# EAGLE design Qwiic Pressure Sensor - LPS25HB (EAGLE 9.0.1)
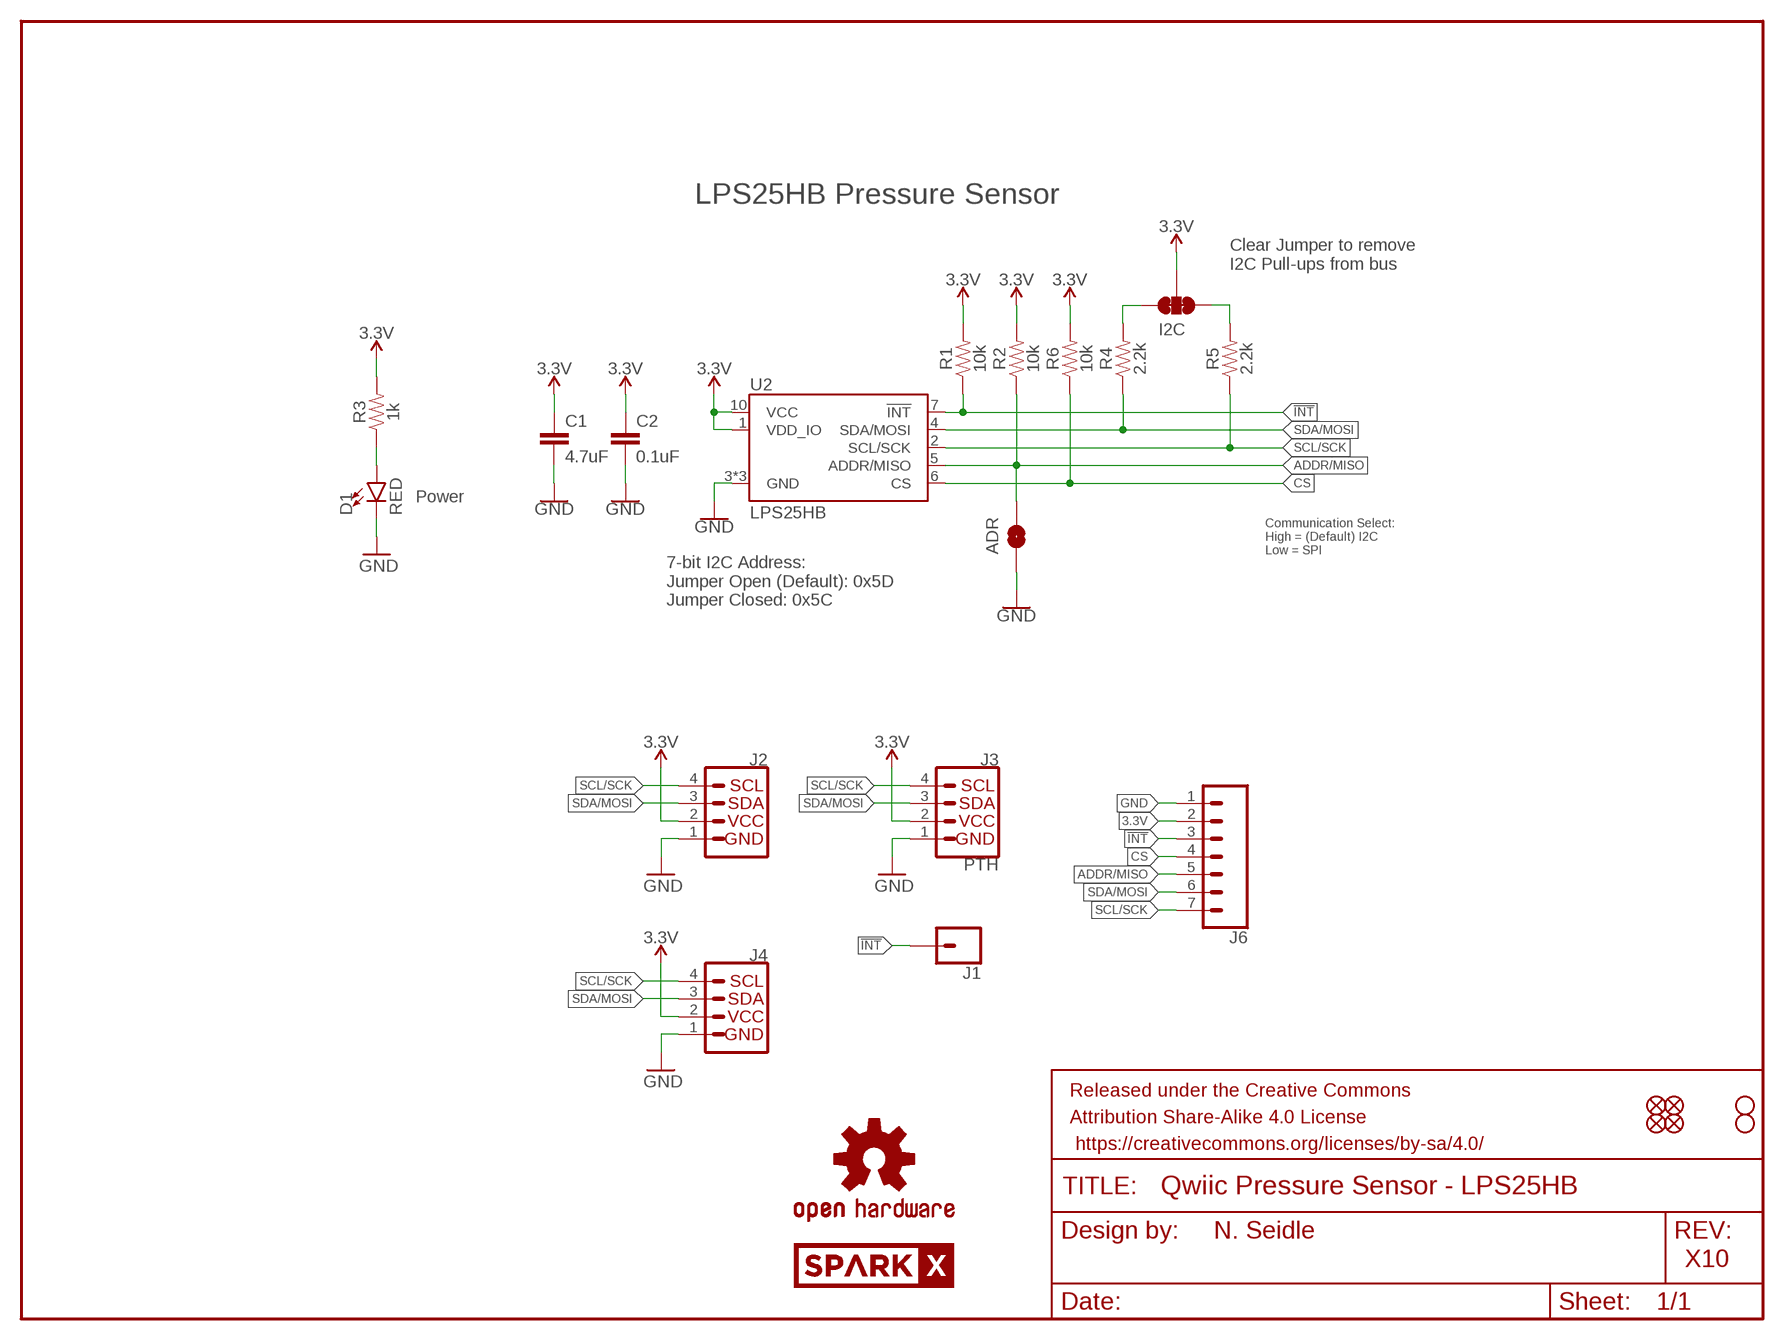
[diagram p0: schematic, sheet 1]

## Parts
ADR  JUMPER-SMT_2_NO_SILK  [SMT-JUMPER_2_NO_SILK]
C1  4.7uF  4.7UF0603  [0603]
C2  0.1uF  0.1UF-0603-25V-(+80/-20%)  [0603]
D1  RED  LED-RED0603  [LED-0603]
FRAME1  FRAME-LETTER  [CREATIVE_COMMONS]
I2C  JUMPER-SMT_3_2-NC_TRACE_SILK  [SMT-JUMPER_3_2-NC_TRACE_SILK]
J1  CONN_01PTH_NO_SILK_YES_STOP  [1X01_NO_SILK]
J2  I2C_STANDARDQWIIC  [1X04_1MM_RA]
J3  PTH  I2C_STANDARD_NO_SILK  [1X04_NO_SILK]
J4  I2C_STANDARDQWIIC  [1X04_1MM_RA]
J6  CONN_07NO_SILK  [1X07_NO_SILK]
JP1  FIDUCIALUFIDUCIAL  [MICRO-FIDUCIAL]
JP2  FIDUCIALUFIDUCIAL  [MICRO-FIDUCIAL]
JP3  STAND-OFF  [STAND-OFF]
JP4  STAND-OFF  [STAND-OFF]
JP5  FIDUCIALUFIDUCIAL  [MICRO-FIDUCIAL]
JP6  FIDUCIALUFIDUCIAL  [MICRO-FIDUCIAL]
LOGO1  OSHW-LOGOMINI  [OSHW-LOGO-MINI]
R1  10k  10KOHM-0603-1/10W-1%  [0603]
R2  10k  10KOHM-0603-1/10W-1%  [0603]
R3  1k  1KOHM-0603-1/10W-1%  [0603]
R4  2.2k  2.2KOHM-0603-1/10W-1%  [0603]
R5  2.2k  2.2KOHM-0603-1/10W-1%  [0603]
R6  10k  10KOHM-0603-1/10W-1%  [0603]
U2  LPS25HB  [LPS25HB]
U$2  SPARKX-LOGO4  [SPARKX-MEDIUM]

## Nets
3.3V: C1.1 C2.1 I2C.2 J2.2 J3.2(VCC) J4.2 J6.2 R1.2 R2.2 R3.2 R6.2 U2.1(VDD_IO) U2.10(VCC)
!INT: J1.1 J6.3 R1.1 U2.7(!INT)
ADDR/MISO: ADR.2 J6.5 R2.1 U2.5(ADDR/MISO)
CS: J6.4 R6.1 U2.6(CS)
GND: ADR.1 C1.2 C2.2 D1.C J2.1 J3.1(GND) J4.1 J6.1 U2.3(GND) U2.8(GND) U2.9(GND)
N$1: I2C.1 R5.2
N$2: I2C.3 R4.2
N$3: D1.A R3.1
SCL/SCK: J2.4 J3.4(SCL) J4.4 J6.7 R5.1 U2.2(SCL/SCK)
SDA/MOSI: J2.3 J3.3(SDA) J4.3 J6.6 R4.1 U2.4(SDA/MOSI)

## Notes on the sheet
- LPS25HB Pressure Sensor
- Clear Jumper to remove 
  I2C Pull-ups from bus
- Power
- Communication Select: 
  High = (Default) I2C
  Low = SPI
- 7-bit I2C Address:
  Jumper Open (Default): 0x5D
  Jumper Closed: 0x5C
- N. Seidle
- X10

## Library data of the parts
ADR = SparkFun-Jumpers:JUMPER-SMT_2_NO: Normally open jumper This jumper has two pads in close proximity to each other. Apply solder to close the connection. Round pads are easier to solder for beginners, but are a lot larger. SparkFun Product that uses the round pads: SparkFun EL Sequencer <https://www.sparkfun.com/products/12781>
C1 = SparkFun-Capacitors:4.7UF: 4.7µF ceramic capacitors A capacitor is a passive two-terminal electrical component used to store electrical energy temporarily in an electric field.; PROD_ID: CAP-08280
C2 = SparkFun-Capacitors:0.1UF: 0.1µF ceramic capacitors A capacitor is a passive two-terminal electrical component used to store electrical energy temporarily in an electric field.; PROD_ID: CAP-00810
D1 = SparkFun-LED:LED-RED: Red SMD LED Used in manufacturing of most products at SparkFun Packages: 0603 - SMD 0603 package [Product Link] <http://docs.avagotech.com/docs/AV02-0551EN> 0603 SMART - SMD 0603 SMART package ( more efficient and expensive)[Product Link] <http://www.osram-os.com/Graphics/XPic2/00077099_0.pdf> 1206 - SMD1206 package [Product Link] <https://www.sparkfun.com/datasheets/DevTools/LilyPad/Q150OVS4.pdff> SparkFun Products: Pro Mini 328 -5V <https://www.sparkfun.com/products/821> RedBoard <https://www.sparkfun.com/products/12757> IOIO-OTG <https://www.sparkfun.com/products/13613>; PROD_ID: DIO-00819
FRAME1 = SparkFun-Aesthetics:FRAME-LETTER: Schematic Frame - Letter Standard 8.5x11 US Letter frame
I2C = SparkFun-Jumpers:JUMPER-SMT_3_2-NC_TRACE: Normally closed trace jumper (2 of 2 connections) This jumper has a trace between all three pads so they are normally closed (NC). Use a razor knife to open the connection(s). For best results follow the IPC guidelines for cutting traces: Cutout at least 0.063 mm (0.005 in). Remove all loose material to clean up the cut area. Seal the cut with an approved epoxy. Reapply solder to reclose the connection(s).
J1 = SparkFun-Connectors:CONN_01: Single connection point. Often used as Generic Header-pin footprint for 0.1 inch spaced/style header connections On any of the 0.1 inch spaced packages, you can populate with these: Break Away Headers - Straight <https://www.sparkfun.com/products/116> (PRT-00116) Break Away Male Headers - Right Angle <https://www.sparkfun.com/products/553> (PRT-00553) Female Headers <https://www.sparkfun.com/products/115> (PRT-00115) Break Away Headers - Machine Pin <https://www.sparkfun.com/products/117> (PRT-00117) Break Away Female Headers - Swiss Machine Pin <https://www.sparkfun.com/products/743> (PRT-00743) This device is also useful as a general connection point to wire up your design to another part of your project. Our various solder wires solder well into these plated through hole pads. Hook-Up Wire - Assortment (Stranded, 22 AWG) <https://www.sparkfun.com/products/11375> (PRT-11375) Hook-Up Wire - Assortment (Solid Core, 22 AWG) <https://www.sparkfun.com/products/11367> (PRT-11367) View the entire wire category on our website here <https://www.sparkfun.com/categories/141> Special notes: SMTSO-256-ET is a "flush mount" nut for a 4-40 screw. We mostly use this on specialty testbeds; it is a nice way to connect hardware to your PCB at an adjustable hieght. Also note, the SNAP packages are for using a snappable style connector. We sell a baggie of snaps and they are also used on two LilyPad designs: Snap Assortment - 30 pack (male and female) <https://www.sparkfun.com/products/11347> (DEV-11347) LilyPad Arduino SimpleSnap <https://www.sparkfun.com/products/10941> (DEV-10941) LilyPad SimpleSnap Protoboard <https://www.sparkfun.com/products/10940> (DEV-10940)
J2 J4 = SparkFun-Connectors:I2C_STANDARD: SparkFun I2C Standard Pinout Header SparkFun has standardized on a pinout for all I2C based sensor breakouts. This pinout allows I2C boards to be plugged directly into the headers on Arduino Uno compatible boards, and to be daisy chained easily. Example SparkFun Products: SparkFun Atmospheric Sensor Breakout - BME280 <https://www.sparkfun.com/products/13676> SparkFun Altitude/Pressure Sensor Breakout - MPL3115A2 <https://www.sparkfun.com/products/11084> SparkFun TOF Range Finder Sensor - VL6180 <https://www.sparkfun.com/products/12785>; PROD_ID: CONN-13694; VALUE: Qwiic Right Angle
J3 = SparkX:I2C_STANDARD: SparkFun I2C Standard Pinout Header SparkFun has standardized on a pinout for all I2C based sensor breakouts. This pinout allows I2C boards to be plugged directly into the headers on Arduino Uno compatible boards, and to be daisy chained easily. Example SparkFun Products: SparkFun Atmospheric Sensor Breakout - BME280 <https://www.sparkfun.com/products/13676> SparkFun Altitude/Pressure Sensor Breakout - MPL3115A2 <https://www.sparkfun.com/products/11084> SparkFun TOF Range Finder Sensor - VL6180 <https://www.sparkfun.com/products/12785>
J6 = SparkFun-Connectors:CONN_07: Multi connection point. Often used as Generic Header-pin footprint for 0.1 inch spaced/style header connections On any of the 0.1 inch spaced packages, you can populate with these: Break Away Headers - Straight <https://www.sparkfun.com/products/116> (PRT-00116) Break Away Male Headers - Right Angle <https://www.sparkfun.com/products/553> (PRT-00553) Female Headers <https://www.sparkfun.com/products/115> (PRT-00115) Break Away Headers - Machine Pin <https://www.sparkfun.com/products/117> (PRT-00117) Break Away Female Headers - Swiss Machine Pin <https://www.sparkfun.com/products/743> (PRT-00743) For SCREWTERMINALS and SPRING TERMINALS visit here: Screw Terimnals on SparkFun.com <https://www.sparkfun.com/search/results?term=Screw+Terminals> (5mm/3.5mm/2.54mm spacing) This device is also useful as a general connection point to wire up your design to another part of your project. Our various solder wires solder well into these plated through hole pads. Hook-Up Wire - Assortment (Stranded, 22 AWG) <https://www.sparkfun.com/products/11375> (PRT-11375) Hook-Up Wire - Assortment (Solid Core, 22 AWG) <https://www.sparkfun.com/products/11367> (PRT-11367) View the entire wire category on our website here <https://www.sparkfun.com/categories/141> Special notes: Molex polarized connector foot print use with SKU : PRT-08231 with associated crimp pins and housings. 1MM SMD Version SKU: PRT-10208 NOTES ON THE VARIANTS LOCK and LOCK_LONGPADS... This footprint was designed to help hold the alignment of a through-hole component (i.e. 6-pin header) while soldering it into place. You may notice that each hole has been shifted either up or down by 0.005 of an inch from it's more standard position (which is a perfectly straight line). This slight alteration caused the pins (the squares in the middle) to touch the edges of the holes. Because they are alternating, it causes a "brace" to hold the component in place. 0.005 has proven to be the perfect amount of "off-center" position when using our standard breakaway headers. Although looks a little odd when you look at the bare footprint, once you have a header in there, the alteration is very hard to notice. Also,if you push a header all the way into place, it is covered up entirely on the bottom side.
JP1 JP2 JP5 JP6 = SparkFun:FIDUCIAL: Fiducial Alignment Points Various fiducial points for machine vision alignment.
JP3 JP4 = SparkFun:STAND-OFF: Stand Off This is the mechanical footprint for a #4 phillips button head screw. Use the keepout ring to avoid running the screw head into surrounding components. SKU : PRT-00447
LOGO1 = SparkFun-Aesthetics:OSHW-LOGO: Open-Source Hardware (OSHW) Logo This logo indicates the piece of hardware it is found on incorporates a OSHW license and/or adheres to the definition of open source hardware found here: http://freedomdefined.org/OSHW
R1 R2 R6 = SparkFun-Resistors:10KOHM: 10kΩ resistor A resistor is a passive two-terminal electrical component that implements electrical resistance as a circuit element. Resistors act to reduce current flow, and, at the same time, act to lower voltage levels within circuits. - Wikipedia; PROD_ID: RES-00824
R3 = SparkFun-Resistors:1KOHM: 1kΩ resistor A resistor is a passive two-terminal electrical component that implements electrical resistance as a circuit element. Resistors act to reduce current flow, and, at the same time, act to lower voltage levels within circuits. - Wikipedia; PROD_ID: RES-07856
R4 R5 = SparkFun-Resistors:2.2KOHM: 2.2kΩ resistor A resistor is a passive two-terminal electrical component that implements electrical resistance as a circuit element. Resistors act to reduce current flow, and, at the same time, act to lower voltage levels within circuits. - Wikipedia; PROD_ID: RES-08272
U2 = LPS25HB:LPS25HB
U$2 = SparkX:SPARKX-LOGO

## Net classes
1 power: width 0.203 mm

## Board
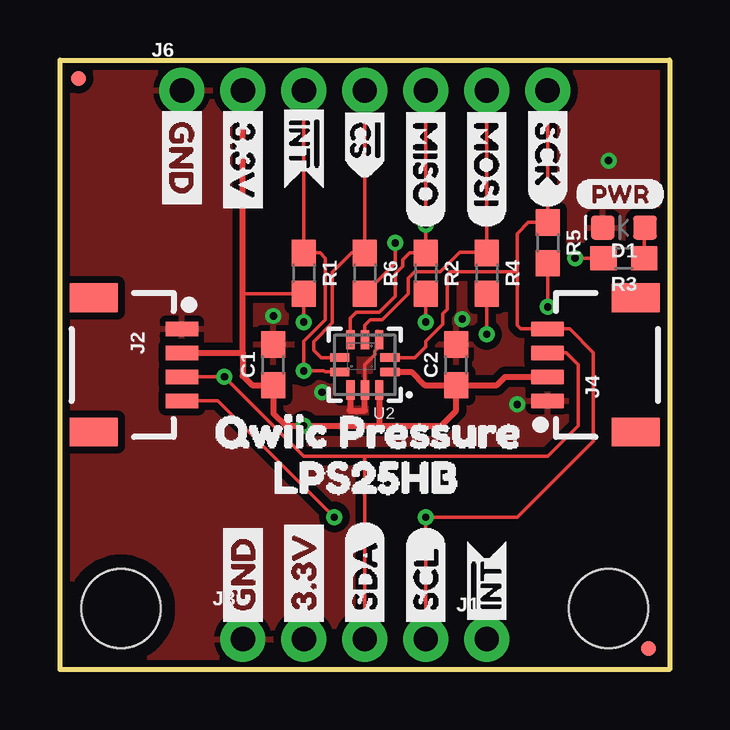
[diagram p1: board, top side]
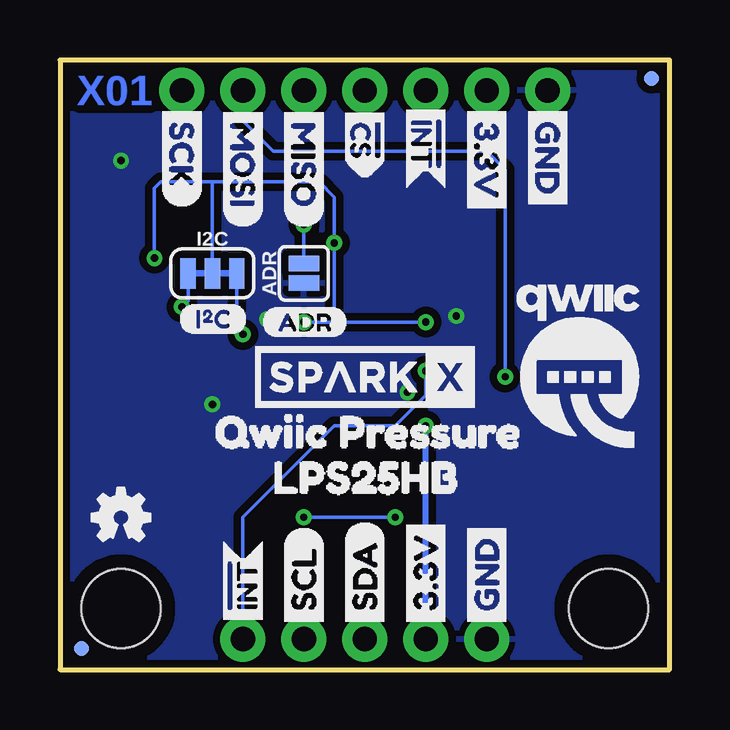
[diagram p2: board, bottom side, seen from below]

Size 25.4 x 25.4 mm. Coordinates in mm from the lower left corner, seen from the top.
Outline: 0,0 0,25.4 25.4,25.4 25.4,0 0,0
Copper layers (1*16): Top 0.035mm / dielectric 1.5mm / Bottom 0.035mm
Design rules "SparkFun-2-layer-PCBWay-LIMIT": minimum track width 6mil, minimum drill 0.3mm, track to track 6mil, track to pad 6mil, pad to pad 6mil, via to via 6mil, smd to smd 6mil, copper to edge 6mil, drill to drill 6mil, minimum pad ring 7mil, minimum via ring 7mil, stop-mask expansion 4mil, vias tented up to drill 25mil, thermal gap 10mil
tRestrict: area 12.3,11.3 to 12.4,11.9; area 11.7,11.3 to 11.8,11.9; area 13.6,13.5 to 13.7,14.1

### Footprints (pad centres in the part's own frame; a part is rotated, then mirrored left to right if it is on the bottom)
SMT-JUMPER_2_NO_SILK = smd 0.635 x 1.27: 1 -0.406,0; 2 0.406,0
0603 = smd 1.1 x 1: 1 -0.85,0; 2 0.85,0
LED-0603 = smd 1 x 1: A -0.877,0; C 0.877,0
SMT-JUMPER_3_2-NC_TRACE_SILK = smd 0.635 x 1.27: 1 -1.016,0; 2 0,0; 3 1.016,0
1X01_NO_SILK = drill 1.016 pad 1.88: 1 0,0
1X04_1MM_RA = smd 0.6 x 1.35: 1 -1.5,0; 2 -0.5,0; 3 0.5,0; 4 1.5,0 | smd 1.2 x 2: NC1 2.8,-3.675; NC2 -2.8,-3.675
1X04_NO_SILK = drill 1.016 pad 1.88: 1 0,0; 2 2.54,0; 3 5.08,0; 4 7.62,0
1X07_NO_SILK = drill 1.016 pad 1.88: 1 0,0; 2 2.54,0; 3 5.08,0; 4 7.62,0; 5 10.16,0; 6 12.7,0; 7 15.24,0
MICRO-FIDUCIAL = smd 0.635 x 0.635: 1 0,0
STAND-OFF = hole 3.302: 0,0
LPS25HB = smd 0.8 x 0.35: 1 -1.05,0.3; 2 -1.05,-0.3; 6 1.05,-0.3; 7 1.05,0.3 | smd 0.35 x 0.8: 3 -0.6,-1.05; 4 0,-1.05; 5 0.6,-1.05; 8 0.6,1.05; 9 0,1.05; 10 -0.6,1.05

### Placement (x,y rotation side)
ADR  15.24,16.51 90 bottom
C1  8.89,12.7 90 top
C2  16.51,12.7 90 top
D1  23.5,18.41 180 top
FRAME1  -20.32,-17.78 0 top  (outside the outline)
I2C  19.05,16.51 0 bottom
J1  17.78,1.27 0 top
J2  5.08,12.7 270 top
J3  7.62,1.27 0 top
J4  20.32,12.7 90 top
J6  5.08,24.13 0 top
JP1  0.76,24.64 0 bottom
JP2  24.51,0.89 0 top
JP3  2.54,2.54 0 top
JP4  22.86,2.54 0 top
JP5  24.51,0.89 0 bottom
JP6  0.76,24.64 0 top
LOGO1  22.86,6.35 0 bottom
R1  10.16,16.51 270 top
R2  15.24,16.51 270 top
R3  23.5,17.14 180 top
R4  17.78,16.51 270 top
R5  20.32,17.78 270 top
R6  12.7,16.51 270 top
U2  12.7,12.7 180 top
U$1  [QWIIC_PRESSURE1]  20.07,9.91 0 bottom
U$2  12.7,12.19 0 bottom
U$3  [GND1]  7.62,1.52 90 bottom
U$4  [3#3V2]  10.16,1.52 90 bottom
U$5  [SDA8]  12.7,1.52 90 bottom
U$6  [SCL9]  15.24,1.52 90 bottom
U$7  [LPS25HB0]  17.65,8 0 bottom
U$9  [QWIIC-LOGO-MEDIUM]  3.81,12.7 0 bottom
U$10  [MISO]  15.24,23.75 270 top
U$11  [MISO]  15.24,23.75 270 bottom
U$12  [I_SUPER2_C-()-03]  20.45,14.61 0 bottom
U$15  [PWR-()-03]  21.46,19.81 0 top
U$16  [MOSI]  17.78,23.75 270 bottom
U$17  [MOSI]  17.78,23.75 270 top
U$18  [SCK-[)]  20.32,23.75 270 top
U$19  [SCK-[)]  20.32,23.75 270 bottom
U$20  [CS#-[>]  12.7,23.88 270 top
U$21  [3#3V2]  10.16,1.52 90 top
U$22  [GND1]  7.62,1.52 90 top
U$23  [CS#-[>]  12.7,23.88 270 bottom
U$24  [INT#-[<]  10.16,24 270 top
U$25  [INT#-[<]  10.16,24 270 bottom
U$26  [SCL9]  15.24,1.52 90 top
U$27  [SDA8]  12.7,1.52 90 top
U$28  [INT#-[<]  17.78,1.4 90 top
U$29  [INT#-[<]  17.78,1.4 90 bottom
U$30  [3#3V2]  7.62,23.75 270 top
U$31  [GND1]  5.08,23.75 270 top
U$32  [GND1]  5.08,23.75 270 bottom
U$33  [3#3V2]  7.62,23.75 270 bottom
U$34  [ADR-()-03]  17.02,14.48 0 bottom
U$35  [LPS25HB0]  7.75,8 0 top
U$37  [QWIIC_PRESSURE1]  5.33,9.91 0 top

### Tracks (layer width: path | path; a pad name or v marks a point on that pad's centre or on a via)
3.3V  (via drill 0.3)
  Top 0.152: 7.61,15.62 7.65,15.66 R1.2 v10.16,14.48 | R2.2 v15.24,14.48 | R6.2 13.97,16.93 v13.97,17.78 | R3.2 v21.46,17.14
  Top 0.254: C2.1 18.2,11.85 18.55,12.2 J4.2 | C2.1 15.2,11.85 14.65,12.4 U2.1 | J2.2 7.61,13.2 | 13.34,10.16 v10.16,10.16 9.4,10.16 8.89,10.67 C1.1 8,11.85 7.61,12.24 7.61,13.2 | 13.34,10.16 15.88,10.16 16.51,10.79 C2.1 | U2.10 13.3,10.2 13.34,10.16 | 7.61,13.2 7.62,13.21 | 7.61,13.2 7.61,15.62 J6.2
  Bottom 0.152: v15.24,14.48 13.97,14.48 | 13.97,14.48 v10.16,14.48 | 13.97,14.48 v13.97,17.78 13.97,19.68 14.61,20.32 19.05,20.32 | 19.05,20.32 21.21,20.32 21.46,20.07 v21.46,17.14 | I2C.2 19.05,20.32
  Bottom 0.254: J3.2 v10.16,10.16
!INT  (via drill 0.3)
  Top 0.152: U2.7 11.04,12.4 11,12.45 v10.16,12.45 10.16,13.69 11.05,14.58 11.05,17.14 10.83,17.36 R1.1 J6.3
  Bottom 0.152: J1.1 17.78,6.35 13.97,10.16 11.43,10.16 10.16,11.43 v10.16,12.45
ADDR/MISO  (via drill 0.3)
  Top 0.152: U2.5 12.1,14.64 12.34,14.88 13.29,14.88 13.97,15.56 13.97,16.5 14.28,16.8 14.28,17.07 14.57,17.36 R2.1 v15.24,18.54 J6.5
  Bottom 0.152: ADR.2 v15.24,18.54
CS
  Top 0.152: J6.4 R6.1 12.15,17.36 11.35,16.56 11.35,14.45 10.57,13.66 10.57,13.31 10.88,13 U2.6
GND  (via drill 0.3)
  Top 0.152: U2.3 13.3,13.45 13.12,13.27 13.12,13.12 12.7,12.7 U2.9
  Top 0.254: U2.9 12.7,10.79 12.06,10.79 12.1,10.83 U2.8
  other vias: 19.05,11.05 22.86,21.21 10.92,11.56 8.89,14.73 16.76,14.61
  pour Bottom (isolate 0.305): 0,0 0,25.4 25.4,25.4 25.4,0
  pour Top (isolate 0.305): 0,0 0,25.4 25.4,25.4 25.4,0
N$1  (via drill 0.3)
  Top 0.152: v20.32,15.11 R5.2
  Bottom 0.152: I2C.1 20.07,15.37 v20.32,15.11
N$2  (via drill 0.3)
  Top 0.152: v17.78,13.97 R4.2
  Bottom 0.152: I2C.3 18.03,14.22 v17.78,13.97
N$3
  Top 0.152: D1.A 24.34,18.39 R3.1
SCL/SCK  (via drill 0.3)
  Top 0.152: J6.7 R5.1 19.52,18.63 19.05,18.16 19.05,16.64 | U2.2 14.78,13 15.24,13.46 15.24,13.69 15.95,14.4 15.95,14.84 16.13,15.01 16.13,16.45 16.27,16.58 18.99,16.58 19.05,16.64 | J3.4 v15.24,6.35 19.05,6.35 22.23,9.53 22.23,13.21 21.23,14.2 J4.4 19.2,14.2 19.05,14.35 19.05,16.64 | v11.43,6.35 6.58,11.2 J2.4
  Bottom 0.152: v11.43,6.35 v15.24,6.35
SDA/MOSI  (via drill 0.3)
  Top 0.152: R4.1 17.78,17.4 | 17.78,17.4 J6.6 | 17.78,17.4 16.65,17.4 15.84,16.58 14.79,16.58 14.51,16.3 14.51,15.67 13.42,14.58 12.93,14.58 12.7,14.35 U2.4 | 12.7,8.89 J3.3 | 12.7,8.89 10.16,8.89 v6.85,12.2 J2.3 | 12.7,8.89 20.32,8.89 21.59,10.16 21.59,12.7 21.09,13.2 J4.3
  Bottom 0.152: v6.85,12.2 6.85,20.82 7.62,21.59 16.51,21.59 17.78,22.86 J6.6

### Text on the board
Bottom: X01